# Altium schematic sheet PCBRecSCH.SchDoc
size A; SheetNumber: 1; SheetTotal: 1
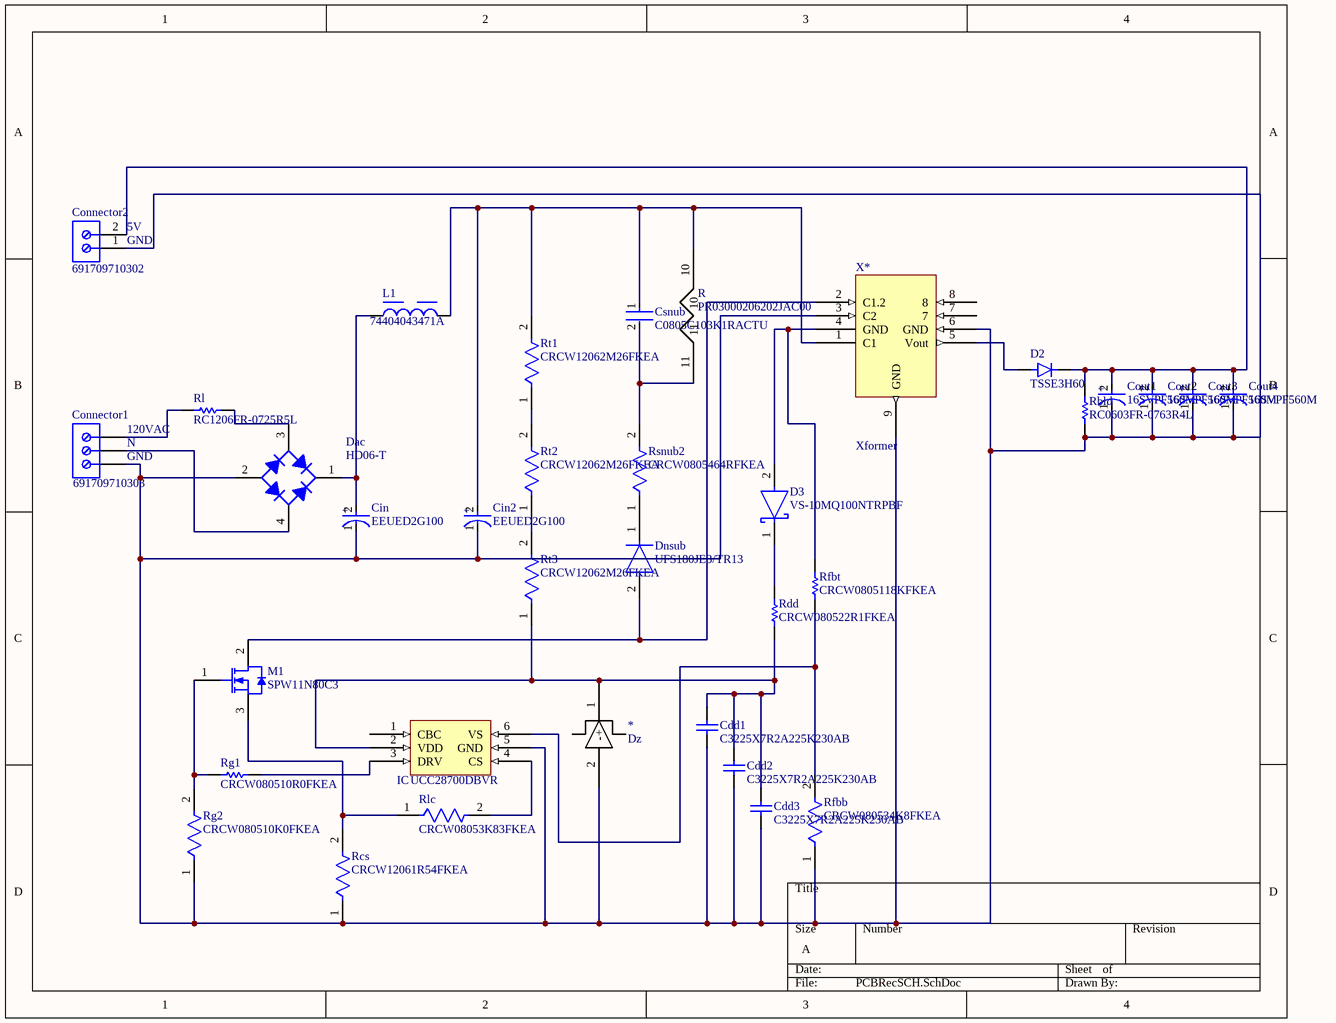
[diagram p0: PCBRecSCH.SchDoc]

## Parts
*  Dz  [DIOM505270X240]
Cdd1  C3225X7R2A225K230AB  [CAPC3225X250X20LL40]
Cdd2  C3225X7R2A225K230AB  [CAPC3225X250X20LL40]
Cdd3  C3225X7R2A225K230AB  [CAPC3225X250X20LL40]
Cin  EEUED2G100  [FP-RAD-TH-D_10_0_5-L_20_2-MFG]
Cin2  EEUED2G100  [FP-RAD-TH-D_10_0_5-L_20_2-MFG]
Connector1  691709710303  [691709710303]
Connector2  691709710302  [691709710302]
Cout1  16SVPF560M  [FP-OS-CON-SMT-E12-MFG]
Cout2  16SVPF560M  [FP-OS-CON-SMT-E12-MFG]
Cout3  16SVPF560M  [FP-OS-CON-SMT-E12-MFG]
Cout4  16SVPF560M  [FP-OS-CON-SMT-E12-MFG]
Csnub  C0805C103K1RACTU  [FP-C0805C-DN-MFG]
D2  TSSE3H60  [DIO_TSSE3H60]
D3  VS-10MQ100NTRPBF  [FP-95400-MFG]
Dac  HD06-T  [DIOD-MiniDIP-4_V]
Dnsub  UFS180JE3/TR13  [FP-DO-214BA-MFG]
IC  UCC28700DBVR  [SOT95P280X145-6N]
L1  74404043471A  [WE-LQS_4025]
M1  SPW11N80C3  [INF-PG-TO247-3-21]
R  PR03000206202JAC00  [PCBComponent_1]
Rbld  RC0603FR-0763R4L  [RESC1608X55X25NL10T15]
Rcs  CRCW12061R54FKEA  [FP-CRCW1206-e3-MFG]
Rdd  CRCW080522R1FKEA  [RESC2013X50X30ML20T20]
Rfbb  CRCW080534K8FKEA  [FP-CRCW0805-e3-IPC_C]
Rfbt  CRCW0805118KFKEA  [RESC2013X50X30ML20T20]
Rg1  CRCW080510R0FKEA  [RESC2013X50X30NL20T20]
Rg2  CRCW080510K0FKEA  [FP-CRCW0805-e3-IPC_A]
Rl  RC1206FR-0725R5L  [RESC3116X65X40NL10T20]
Rlc  CRCW08053K83FKEA  [FP-CRCW0805-e3-IPC_B]
Rsnub2  CRCW0805464RFKEA  [FP-CRCW0805-e3-IPC_A]
Rt1  CRCW12062M26FKEA  [FP-CRCW1206-e3-MFG]
Rt2  CRCW12062M26FKEA  [FP-CRCW1206-e3-MFG]
Rt3  CRCW12062M26FKEA  [FP-CRCW1206-e3-MFG]
X*  Xformer  [PCBComponent_1]

## Nets
Net*_1: *.1(+) Cdd1.2 Cdd2.2 Cdd3.2 IC.2(VDD) Rdd.1 Rt3.1
Net*_2: *.2(-) Cdd1.1 Cdd2.1 Cdd3.1 Cin.1(C) Cin2.1(C) Connector1.1 Connector2.1 Cout1.1(C) Cout2.1(C) Cout3.1(C) Cout4.1(C) Dac.2(A) IC.5(GND) Rbld.1 Rcs.1 Rfbb.1 Rg2.1 X*.3(C2) X*.6(GND) X*.9(GND)
NetCin2_2: Cin2.2(A) Csnub.1 L1.2 R.10 Rt1.2 X*.1(C1)
NetCin_2: Cin.2(A) Dac.1(K) L1.1
NetConnector1_2: Connector1.2 Dac.4(C)
NetConnector1_3: Connector1.3 Rl.1
NetConnector2_2: Connector2.2 Cout1.2(A) Cout2.2(A) Cout3.2(A) Cout4.2(A) D2.C(K) Rbld.2
NetCsnub_2: Csnub.2 R.11 Rsnub2.2
NetD2_A: D2.A X*.5(Vout)
NetD3_1: D3.1(C) Rdd.2
NetD3_2: D3.2(A) Rfbt.2 X*.4(GND)
NetDac_3: Dac.3(C) Rl.2
NetDnsub_1: Dnsub.1(C) Rsnub2.1
NetDnsub_2: Dnsub.2(A) M1.2(DRAIN) X*.2(C1.2)
NetIC_3: IC.3(DRV) Rg1.2
NetIC_4: IC.4(CS) Rlc.2
NetIC_6: IC.6(VS) Rfbb.2 Rfbt.1
NetM1_1: M1.1(GATE) Rg1.1 Rg2.2
NetM1_3: M1.3(SOURCE) Rcs.2 Rlc.1
NetRt1_1: Rt1.1 Rt2.2
NetRt2_1: Rt2.1 Rt3.2

Not connected (* = marked no-connect by the designer): IC 1(CBC); X* 7 8

## Notes on the sheet
- (near Connector2) 5V
- (near Connector2) GND
- 120VAC
- (near Connector1) N
- (near Connector1) GND
- (in symbol CMP-05427-001613-1) +
- (in symbol CMP-05428-001239-1) +

## Library data of the parts
* R = Component_1
Cdd1-Cdd3 = CMP-2000-06053-1: Chip Capacitor, 2.2 uF, +/- 10%, -55 to 125 degC, 1210 (3225 Metric), RoHS, Tape and Reel; PCN Part Number: MLCCPartNumberChange30/Nov/2012; Manufacturer: TDK; Capacitance: 2.2µF; Catalog Drawings: CSERIES_1210_2.5; Product Training Modules: SEAT,CCV,andTVCLDesignToolsGuidetoReplacinganElectrolyticCapacitorwithanMLCC; Other Names: 445-4497-6; Voltage - Rated: 100V; Temperature Coefficient: X7R; Featured Product: C-SeriesMidVoltageMLCCs; Online Catalog: CSeries,MidVoltage; Ratings: -; Mounting Technology: SurfaceMount; Height - Seated (Max): -; Applications: GeneralPurpose; Packaging: Digi-Reel®; Mounting Type: SurfaceMount,MLCC; Lead Spacing: -; Thickness (Max): 0.098"(2.50mm); Package Reference: 1210 (3225 Metric); Manufacturer URL: http://www.tdk.com/; Size / Dimension: 0.126"Lx0.098"W(3.20mmx2.50mm); Operating Temperature: -55°C~125°C; Datasheet URL: https://datasheet.ciiva.com/15192/getdatasheetpartid-725361-15192330.pdf; RoHS Information: RoHSCertificate-MLCC; Lead Style: -; Standard Package: 1; Family: CeramicCapacitors; Datasheet Version: 10/2014; Category: Capacitors; Tolerance: ±10%; Features: -; Series: C; Package Description: 2-Pin Surface Mount Device, Body 3.2 x 2.5 mm; Package / Case: 1210(3225Metric)
Cin Cin2 = CMP-05427-001613-1: Aluminum Electrolytic Capacitors (Radial Lead Type) 10uF ±20% 400V; Lead Diameter: 0.6mm; Life (Hours): 8000Hour; Ripple Current (AC): 300mA; Dissipation Factor: 0.24%; Dielectric Material: Aluminium; Polarity: Polar; Voltage: 400V; Number of Pins: 2; Height: 20mm; Case/Package: Radial; REACH SVHC: No SVHC; Max Operating Temperature: 105°C; Construction: RADIAL; Voltage Rating (DC): 400V; Tolerance: 20%; Voltage Rating: 400V; Contact Plating: Tin; Ripple Current: 300mA; Min Operating Temperature: -25°C; Packaging: Bulk; Lead Free: Lead Free; Diameter: 10mm; Height - Seated (Max): 0.787inch; Radiation Hardening: No; Capacitance: 10uF; Termination: Radial; Length: 20mm; Series: ED; Package Quantity: 200; Mount: Through Hole; Lead Pitch: 5mm; RoHS Compliant: Yes
Connector1 = CMP-1502-03336-2: NexarPartId: 34171770; Number of Contacts: 3; Voltage Rating: 300V; Connector Type: Screw; Current Rating: 6A; Wire/Cable Gauge: 30AWG; Plating: Steel; Number of Levels: 1; Wire Gauge (Min): 14AWG; Pitch: 5mm; Termination: Screw; Contact Plating: Tin; Max Operating Temperature: 130°C; Color: Black; RoHS: Compliant; Contact Material: Nickel; Number of Pins: 3; Packaging: Digi-Reel®; REACH SVHC: Unknown; Mount: Surface Mount; Lead Pitch: 5mm; Number of Positions Per Level: 3; Flammability Rating: UL94 V-0; Length: 15mm; Number of Positions: 3; Current: 6A; Min Operating Temperature: -40°C; Number of Rows: 1; Wire Gauge (Max): 30AWG; Housing Material: Nylon; Height: 10.2mm; Voltage: 300V
Connector2 = CMP-1502-03335-2: NexarPartId: 34186867; Number of Positions: 2; Current Rating: 6A; Number of Levels: 1; Pitch: 5mm; Wire Gauge (Min): 14AWG; Wire Gauge (Max): 30AWG; Connector Type: Screw; Voltage: 300V; Plating: Steel; Housing Material: Nylon; Lead Pitch: 5mm; REACH SVHC: Unknown; Flammability Rating: UL94 V-0; Height: 11.1mm; Termination: Screw; Current: 6A; Contact Plating: Tin; Number of Rows: 1; Max Operating Temperature: 130°C; Color: Black; Mount: Surface Mount; Voltage Rating: 300V; Min Operating Temperature: -40°C; Contact Material: Tin; Wire/Cable Gauge: 30AWG; Packaging: Digi-Reel®; Length: 10mm; Number of Pins: 2; RoHS: Compliant; Number of Contacts: 2; Number of Positions Per Level: 2
Cout1-Cout4 = CMP-05428-001239-1: Conductive Polymer Aluminum Solid Capacitors (OS-CON) 560uF ±20% 16V; Dissipation Factor: 12%; Polarity: Polar; Ripple Current (AC): 4.95A; Life (Hours): 5000Hour; ESR (Equivalent Series Resistance): 14mR; Leakage Current: 1.792mA; Max Operating Temperature: 105°C; Height - Seated (Max): 0.472inch; Capacitance: 560uF; Length: 11.9mm; Voltage Rating: 16V; Tolerance: 20%; Voltage Rating (DC): 16V; RoHS Compliant: Yes; Package Quantity: 400; Case/Package: Radial; Diameter: 8mm; Series: OS-CON™, SVPF; REACH SVHC: No SVHC; Min Operating Temperature: -55°C; Height: 11.9mm; Termination: SMD/SMT; Lead Free: Lead Free; Number of Pins: 12; Mount: Surface Mount; Ripple Current: 4.95A; Packaging: Tape and Reel; Voltage: 16V
Csnub = CMP-03020-018902-1: CAP CER 10000PF 100V X7R 0805; Manufacturer: KEMET; Capacitance: 10,000 pF; Value: 10,000 pF; Temperature Coefficient: 30ppm/°C; Tolerance: 0.1; Octopart: https://octopart.com/c0805c103k1ractu-kemet-97824; Material: Ceramic; Ipc Land Pattern Name: CAPC200125X78; Temperature: -55°C to +125°C; Temperature Range High: +125°C; Temperature Range Low: -55°C; Category: Cap; Voltage Rating: 100 V; ComponentLink2Description: Datasheet; Device Class L3: Ceramic Capacitors; ComponentLink2URL: https://content.kemet.com/datasheets/KEM_C1003_C0G_SMD.pdf; Automotive: No; Temperature Characteristic: X7R; Digikey Description: CAP CER 10000PF 100V X7R 0805; Package: C0805C-DN; Height: 0.88mm; Device Class L2: Capacitors; Mouser Description: Cap Ceramic 0.01uF 100V X7R 10% SMD 0805 125°C Paper T/R; Device Class L1: Passive Components; Lead Free: Yes; RoHS: TRUE; Manufacturer Part Number: C0805C103K1RACTU
D2 = TSSE3H60: MF: Taiwan Semiconductor; MP: TSSE3H60; Availability: Unavailable; Package: None; Value: *; Price: None
D3 = CMP-02539-000001-1: DIODE SCHOTTKY 100V 1A SMA; Manufacturer: Vishay; Forward Current: 1.5A; Max Surge Forward Current: 30A; Standoff Height: 0mm; Value: 38pF; Max Junction Temp: +150°C; Peak Reverse Current: 0.1mA; Octopart: https://octopart.com/vs-10mq100ntrpbf-vishay-44340924; Max Repetitive Reverse Voltage: 100V; ComponentLink2Description: Datasheet; ComponentLink2URL: http://www.vishay.com/docs/94119/vs-10mq100ntrpbf.pdf; Reverse Voltage: 100V; Digikey Description: DIODE SCHOTTKY 100V 1A SMA; Mouser Description: DIODE SCHOTTKY 100V 1A SMA; Lead Free: Yes; Device Class L2: Diodes; Temperature Range Low: -55°C; Package: 95400; Height: 2.29mm; Capacitance: 38pF; Device Class L1: Discrete Semiconductors; Footprint Url: https://www.vishay.com/docs/95400/sma.pdf; Temperature: -55°C to +150°C; Temperature Range High: +150°C; RoHS: TRUE; Category: Diode; Manufacturer Part Number: VS-10MQ100NTRPBF; Device Class L3: Schottky Diodes; Automotive: No
Dac = CMP-2000-06395-1: Glass Passivated Bridge Rectifier, 0.8 A, 600 V, -55 to 150 degC, 4-Pin MiniDIP, RoHS, Tape and Reel; Manufacturer: Diodes Inc; Average Rectified Current-Max: 0.8A; Reverse Voltage-Max [Vrrm]: 600V; Forward Voltage: 1V; Peak Current-Max: 30A; Reverse Current-Max: 5µA; Package Version: 05/2016; Package URL: http://www.diodes.com/_files/packages/MiniDIP.pdf; Datasheet Version: Rev. 13-2, 12/2010; Datasheet URL: http://www.diodes.com/_files/datasheets/ds17003.pdf; Mounting Technology: SurfaceMount; Manufacturer URL: http://www.diodes.com/; Package Reference: MiniDIP-4; Package Description: 4-Pin Small Outline Integrated Circuit, Body 4.7 x 3.8 mm, Pitch 2.5 mm
Dnsub = CMP-00252-99194895-1: UFS180JE3/TR13 Rectifier Diode, 1 Phase, 1 Element, 1A, 800V V(RRM); Reverse Recovery Time: 60ns; Number of Pins: 2; NexarPartId: 99194895; Mount: Surface Mount; Max Reverse Voltage (DC): 800V; RoHS: Compliant; Average Rectified Current: 1A; Lead Free: Lead Free
IC = Component_2
L1 = CMP-03913-77814864-1: 74404043471A Inductor, 470Uh, Semishielded, 0.25A Rohs Compliant: Yes; Inductance: 470µH; DC Resistance (DCR): 4.15Ω; Inductance Tolerance: 20%; Current Rating: 250mA; Ambient Temperature Range High: 85°C; Ambient Temperature Range Low: -40°C; Max Operating Temperature: 125°C; RoHS: Compliant; Min Operating Temperature: -40°C; Height: 2.5mm; NexarPartId: 77814864; Width: 4mm; Length: 4mm
M1 = CMP-1165-00025-1: N-Channel CoolMOS Power-Transistor, 800 V VDS, 11 A ID, -55 to 150 degC, PG-TO247-3-21, Tube, Green; Manufacturer: Infineon; RthJA (max): 62Â K/W; Ptot (max): 156Â W; RDS (on) (max): 450Â mOhm; QG: 64Â nC; VGS(th) (min): 2.1Â V; VGS(th) (max): 3.9Â V; Polarity: N; VDS (max): 800Â V; RthJC (max): 0.8Â K/W; IDpuls (max): 33Â A; ID (max): 11Â A; Green: TRUE; Mode: Enhancement; PartNumber: SPW11N80C3; PackageVersion: Oct-07; Packing: Tube; DatasheetVersion: Rev. 2.91; ComponentLink1URL: http://www.infineon.com/; ComponentLink3Description: Package Specification; Halogen-free: available; PackageDescription: 3-Pin Plastic (Green) Transistor Single Outline Package, 15.87 x 20.96 mm Body, 5.44 mm Pitch; Mounting Technology: Through Hole; Technology: CoolMOS C3; ComponentLink1Description: Manufacturer URL; ComponentLink2URL: http://www.infineon.com/dgdl/SPW11N80C3_rev2.91.pdf?folderId=db3a304412b407950112b408e8c90004&fileId=db3a304412b407950112b42bf6e0463d; Rth: 0.8Â K/W; PackageReference: PG-TO247-3-21; ComponentLink2Description: Datasheet; ComponentLink3URL: http://www.infineon.com/dgdl/DS_IK30N100T_1_1.pdf?folderId=db3a304412b407950112b408e8c90004&fileId=db3a304316f66ee80116f7b6e3920050&location=en.Products.IGBTs.IGBT_with_Anti-Parallel_Diode.TRENCHSTOP__IGBT_for_Hard_Switching.DATASHEET.DS_IK30N100T_1_1.pdf
Rbld = CMP-2000-04106-1: Manufacturer: Yageo; Part Number: RC0603FR-0763R4L
Rcs = CMP-02407-002193-1: RES Thick Film, 1.54Ω, 1%, 0.25W, 100ppm/°C, 1206; Power Rating: 250mW; Voltage Rating (DC): 200V; Resistance: 1.54R; Number of Terminations: 2; Composition: Thick Film; Case Code (Metric): 3216; Case/Package: 1206; Height: 0.024inch; Max Operating Temperature: 155°C; Features: Automotive AEC-Q200; Contact Plating: Tin; Max Power Dissipation: 250mW; Radiation Hardening: No; Case Code (Imperial): 1206; Min Operating Temperature: -55°C; Package Quantity: 10; Weight: 0.000353oz; Tolerance: 1%; Length: 0.126inch; Lead Free: Lead Free; Width: 0.063inch; Packaging: Tape and Reel; Voltage Rating: 200V; Termination: SMD/SMT; Temperature Coefficient: 100ppm/°C
Rdd = CMP-2001-03695-1: Manufacturer: Vishay Dale; Part Number: CRCW080522R1FKEA
Rfbb = CMP-2001-03838-2: RES Thick Film, 34.8kΩ, 1%, 0.125W, 100ppm/°C, 0805; Voltage Rating: 150V; Resistance: 34.8kR; Power Rating: 125mW; Military Standard: Not; Package Quantity: 5000; Composition: Thick Film; Min Operating Temperature: -55°C; Height: 0.45mm; Width: 1.25mm; Contact Plating: Tin; Temperature Coefficient: 100ppm/°C; Termination: SMD/SMT; Lead Free: Lead Free; Case/Package: 0805; Case Code (Imperial): 0805; Voltage Rating (DC): 150V; Length: 2mm; Case Code (Metric): 2012; Number of Pins: 2; Max Operating Temperature: 155°C; Tolerance: 1%; Depth: 1.25mm; Weight: 0.000194oz; Packaging: Tape and Reel
Rfbt = CMP-2001-04922-1: Manufacturer: Vishay Dale; Part Number: CRCW0805118KFKEA
Rg1 = CMP-2001-04915-1: Manufacturer: Vishay Dale; Part Number: CRCW080510R0FKEA
Rg2 = CMP-2001-04908-2: RES Thick Film, 10kΩ, 1%, 0.125W, 100ppm/°C, 0805; Resistance: 10kR; Voltage Rating (DC): 150V; Power Rating: 125mW; Weight: 0.000194oz; Package Quantity: 5000; Military Standard: Not; Max Operating Temperature: 155°C; Temperature Coefficient: 100ppm/°C; Contact Plating: Tin; Width: 1.25mm; Height: 0.45mm; Radiation Hardening: No; Tolerance: 1%; Min Operating Temperature: -55°C; Voltage Rating: 150V; Length: 2mm; Depth: 1.25mm; Termination: SMD/SMT; Packaging: Tape and Reel; Case/Package: 0805; Case Code (Metric): 2012; Lead Free: Lead Free; Case Code (Imperial): 0805; Composition: Thick Film
Rl = CMP-1014-00328-2: Manufacturer: Yageo; Part Number: RC1206FR-0725R5L
Rlc = CMP-2001-03885-2: RES Thick Film, 3.83kΩ, 1%, 0.125W, 100ppm/°C, 0805; Working Voltage: 150V; Power Rating: 125mW; Resistance: 3.83kR; Features: Automotive AEC-Q200; Width: 1.25mm; Lead Free: Lead Free; Voltage Rating: 150V; Package Quantity: 5000; Depth: 1.25mm; Weight: 0.000194oz; Number of Terminations: 2; Temperature Coefficient: 100ppm/°C; Radiation Hardening: No; Packaging: Tape and Reel; Max Power Dissipation: 125mW; Height: 0.45mm; Case Code (Metric): 2012; Min Operating Temperature: -55°C; Voltage Rating (DC): 150V; Max Operating Temperature: 155°C; Case/Package: 0805; Contact Plating: Tin; Length: 2mm; Tolerance: 1%; Number of Pins: 2; Case Code (Imperial): 0805; Composition: Thick Film; Military Standard: Not; Termination: SMD/SMT
Rsnub2 = CMP-2001-03927-2: RES Thick Film, 464Ω, 1%, 0.125W, 100ppm/°C, 0805; Voltage Rating: 150V; Power Rating: 125mW; Resistance: 464R; Case Code (Imperial): 0805; Packaging: Tape and Reel; Case Code (Metric): 2012; Width: 0.049inch; Weight: 0.000194oz; Temperature Coefficient: 100ppm/°C; Number of Terminations: 2; Min Operating Temperature: -55°C; Package Quantity: 5000; Contact Plating: Tin; Termination: SMD/SMT; Length: 2mm; Depth: 1.25mm; Lead Free: Lead Free; Features: Automotive AEC-Q200; Max Operating Temperature: 155°C; Composition: Thick Film; Height: 0.45mm; Max Power Dissipation: 125mW; Case/Package: 0805; Tolerance: 1%; Radiation Hardening: No; Military Standard: Not; Voltage Rating (DC): 150V
Rt1-Rt3 = CMP-02407-002001-1: RES Thick Film, 2.26MΩ, 1%, 0.25W, 100ppm/°C, 1206; Resistance: 2.26MR; Voltage Rating: 200V; Max Power Dissipation: 250mW; Mount: Surface Mount; Width: 0.063inch; Packaging: Tape and Reel; Number of Terminations: 2; Case Code (Metric): 3216; Number of Pins: 2; Weight: 0.000353oz; Min Operating Temperature: -55°C; Lead Free: Lead Free; Military Standard: Not; Features: Automotive AEC-Q200; Case/Package: 1206; Depth: 1.6mm; Case Code (Imperial): 1206; Length: 3.2mm; Height: 0.024inch; Temperature Coefficient: 100ppm/°C; Power Rating: 250mW; Radiation Hardening: No; Max Operating Temperature: 155°C; Composition: Thick Film; Tolerance: 1%; Contact Plating: Tin; Package Quantity: 10; Voltage Rating (DC): 200V
X* = Component_4